# Altium schematic sheet Avionics.SchDoc
size 297 x 210 mm
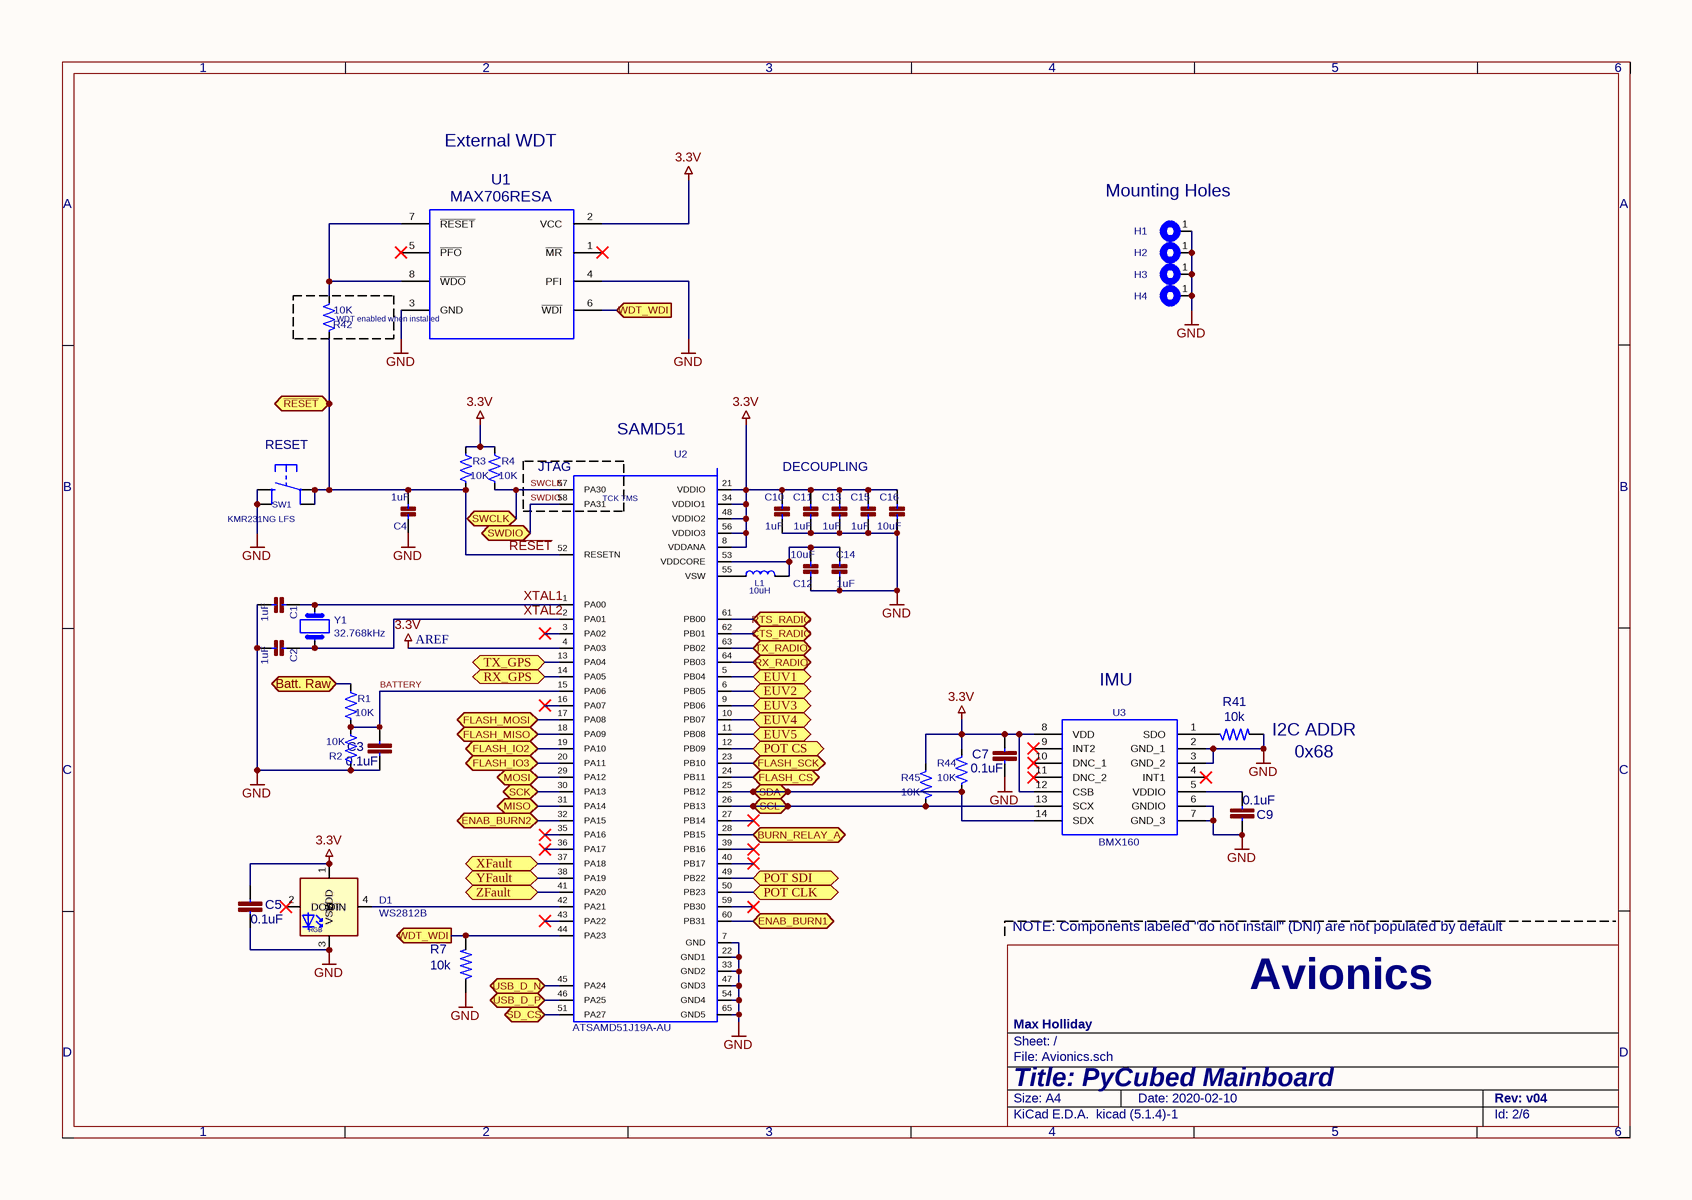
[diagram p0: Avionics.SchDoc]

## Parts
C1  1uF  [C_0603_1608Metric]
C2  1uF  [C_0603_1608Metric]
C3  0.1uF  [C_0603_1608Metric]
C4  1uF  [C_0603_1608Metric]
C5  0.1uF  [C_0603_1608Metric]
C7  0.1uF  [C_0603_1608Metric]
C9  0.1uF  [C_0603_1608Metric]
C10  1uF  [C_0603_1608Metric]
C11  1uF  [C_0603_1608Metric]
C12  10uF  [C_0603_1608Metric]
C13  1uF  [C_0603_1608Metric]
C14  1uF  [C_0603_1608Metric]
C15  1uF  [C_0603_1608Metric]
C16  10uF  [C_0603_1608Metric]
D1  WS2812B  [LED_WS2812B_PLCC4_5.0x5.0mm_P3.2mm]
H1  MountingHole_Pad  [MountingHole_3.2mm_M3_DIN965_Pad]  (value not drawn)  (no BOM)
H2  MountingHole_Pad  [MountingHole_3.2mm_M3_DIN965_Pad]  (value not drawn)  (no BOM)
H3  MountingHole_Pad  [MountingHole_3.2mm_M3_DIN965_Pad]  (value not drawn)  (no BOM)
H4  MountingHole_Pad  [MountingHole_3.2mm_M3_DIN965_Pad]  (value not drawn)  (no BOM)
L1  10uH  [L_0805_2012Metric_Pad1.15x1.40mm_HandSolder]
R1  10K  [R_0603_1608Metric]
R2  10K  [R_0603_1608Metric]
R3  10K  [R_0603_1608Metric]
R4  10K  [R_0603_1608Metric]
R7  10k  [R_0603_1608Metric]
R41  10k  [R_0603_1608Metric]
R42  10K  [R_0603_1608Metric]
R44  10K  [R_0603_1608Metric]
R45  10K  [R_0603_1608Metric]
SW1  KMR231NG LFS  [BTN_KMR2_4.6X2.8]
U1  MAX706RESA  [SO-8_3.9x4.9mm_P1.27mm]
U2  Proto: ATSAMD51J19A-AU  [ATSAMD51J19A-MU]  (hidden comment: 120MHZ 512KB Flash 64 TQFP)
U3  BMX160  [BMX160]
Y1  32.768kHz  [Crystal_SMD_3215-2Pin_3.2x1.5mm]

## Blocks framed on the sheet
WDT enabled / when installed: R42

## Ports
Batt. Raw (bidir), BURN_RELAY_A (bidir), CTS_RADIO (bidir), ENAB_BURN1 (bidir), ENAB_BURN2 (bidir), EUV1 (bidir), EUV2 (bidir), EUV3 (bidir), EUV4 (bidir), EUV5 (bidir), FLASH_CS (bidir), FLASH_IO2 (bidir), FLASH_IO3 (bidir), FLASH_MISO (bidir), FLASH_MOSI (bidir), FLASH_SCK (bidir), MISO (bidir), MOSI (bidir), POT CLK (bidir), POT CS (bidir), POT SDI (bidir), RTS_RADIO (bidir), RX_GPS (bidir), RX_RADIO (bidir), SCK (bidir), SCL (bidir), SD_CS (bidir), SDA (bidir), SWCLK (bidir), SWDIO (bidir), TX_GPS (bidir), TX_RADIO (bidir), USB_D_N (bidir), USB_D_P (bidir), WDT_WDI (in), WDT_WDI (out), XFault (bidir), YFault (bidir), ZFault (bidir), ~{RESET} (bidir)

## Nets
3.3V: C5.1 C7.1 C10.1 C11.1 C13.1 C15.1 C16.1 D1.1(VDD) R3.1 R4.1 R44.1 R45.1 U1.2(VCC) U2.4(PA03) U2.8(VDDANA) U2.21(VDDIO) U2.34(VDDIO1) U2.48(VDDIO2) U2.56(VDDIO3) U3.8(VDD) U3.12(CSB)
GND: C1.2 C2.2 C3.2 C4.1 C5.2 C7.2 C9.1 C10.2 C11.2 C12.1 C13.2 C14.2 C15.2 C16.2 D1.3(VSS) H1.1 H2.1 H3.1 H4.1 R2.1 R7.1 R41.2 SW1.B(S) SW1.B'(S1) U1.3(GND) U1.4(PFI) U2.7(GND) U2.22(GND1) U2.33(GND2) U2.47(GND3) U2.54(GND4) U2.65(GND5) U3.2(GND_1) U3.3(GND_2) U3.6(GNDIO) U3.7(GND_3)
Batt. Raw: R1.1 ; port Batt. Raw
BATTERY: C3.1 R1.2 R2.2 U2.15(PA06)
BURN_RELAY_A: U2.28(PB15) ; port BURN_RELAY_A
CTS_RADIO: U2.62(PB01) ; port CTS_RADIO
ENAB_BURN1: U2.60(PB31) ; port ENAB_BURN1
ENAB_BURN2: U2.32(PA15) ; port ENAB_BURN2
EUV1: U2.5(PB04) ; port EUV1
EUV2: U2.6(PB05) ; port EUV2
EUV3: U2.9(PB06) ; port EUV3
EUV4: U2.10(PB07) ; port EUV4
EUV5: U2.11(PB08) ; port EUV5
FLASH_CS: U2.24(PB11) ; port FLASH_CS
FLASH_IO2: U2.19(PA10) ; port FLASH_IO2
FLASH_IO3: U2.20(PA11) ; port FLASH_IO3
FLASH_MISO: U2.18(PA09) ; port FLASH_MISO
FLASH_MOSI: U2.17(PA08) ; port FLASH_MOSI
FLASH_SCK: U2.23(PB10) ; port FLASH_SCK
MISO: U2.31(PA14) ; port MISO
MOSI: U2.29(PA12) ; port MOSI
POT CLK: U2.50(PB23) ; port POT CLK
POT CS: U2.12(PB09) ; port POT CS
POT SDI: U2.49(PB22) ; port POT SDI
~{RESET}: C4.2 R3.2 R42.1 SW1.A(P) SW1.A'(P1) U2.52(RESETN) ; port ~{RESET}
RTS_RADIO: U2.61(PB00) ; port RTS_RADIO
RX_GPS: U2.14(PA05) ; port RX_GPS
RX_RADIO: U2.64(PB03) ; port RX_RADIO
SCK: U2.30(PA13) ; port SCK
SCL: R45.2 U2.26(PB13) U3.13(SCX) ; port SCL
SD_CS: U2.51(PA27) ; port SD_CS
SDA: R44.2 U2.25(PB12) U3.14(SDX) ; port SDA
SWCLK: R4.2 U2.57(PA30) ; port SWCLK
SWDIO: U2.58(PA31) ; port SWDIO
TX_GPS: U2.13(PA04) ; port TX_GPS
TX_RADIO: U2.63(PB02) ; port TX_RADIO
USB_D_N: U2.45(PA24) ; port USB_D_N
USB_D_P: U2.46(PA25) ; port USB_D_P
WDT_WDI: R7.2 U1.6(~{WDI}) U2.44(PA23) ; port WDT_WDI
XFault: U2.37(PA18) ; port XFault
XTAL1: C1.1 U2.1(PA00) Y1.1
XTAL2: C2.1 U2.2(PA01) Y1.2
YFault: U2.38(PA19) ; port YFault
ZFault: U2.41(PA20) ; port ZFault
NetC9_2: C9.2 U3.5(VDDIO)
NetC12_2: C12.2 C14.1 L1.1 U2.53(VDDCORE)
NetD1_4: D1.4(DIN) U2.42(PA21)
NetL1_2: L1.2 U2.55(VSW)
NetR41_1: R41.1 U3.1(SDO)
NetR42_2: R42.2 U1.7(~{RESET}) U1.8(~{WDO})

Not connected (* = marked no-connect by the designer): D1 2(DOUT)*; U1 1(~{MR})* 5(~{PFO})*; U2 3(PA02)* 16(PA07)* 27(PB14)* 35(PA16)* 36(PA17)* 39(PB16)* 40(PB17)* 43(PA22)* 59(PB30)*; U3 4(INT1)* 9(INT2)* 10(DNC_1)* 11(DNC_2)*

## Notes on the sheet
- External WDT
- (near H1) Mounting Holes
- (near SW1) RESET
- (near U2) JTAG
- (near U2) TCK
  TMS
- (near U2) SAMD51
- DECOUPLING
- AREF
- (near U3) IMU
- 0x68
- (near R41) I2C ADDR
- NOTE: Components labeled "do not install" (DNI) are not populated by default
- Avionics
- 1
- 2
- 3
- 4
- 5
- 6
- A
- B
- C
- D
- Title: PyCubed Mainboard
- File: Avionics.sch
- Sheet: /
- Max Holliday
- KiCad E.D.A.  kicad (5.1.4)-1
- Size: A4
- Date: 2020-02-10
- Rev: v04
- Id: 2/6
- (in symbol WS2812B) RGB

## Library data of the parts
C1 C2 C4 C10 C11 C13-C15 = CAP_CERAMIC0603_NO-Adafruit_Feather_M4_Express-eagle-import-lab64_SAM32-rescue-SAMD-10-rescue-SAM32-rescue: MPN: CL10A105KB8NNNC; Value: 1uF; Footprint: Capacitor_SMD:C_0603_1608Metric
C3 C5 C7 C9 = 0.1UF-25V(+80_-20%)(0603): MPN: CL10B104KB8NNNL; Value: 0.1uF; Footprint: Capacitor_SMD:C_0603_1608Metric
C12 C16 = CAP_CERAMIC0805-NOOUTLINE-Adafruit_Feather_M4_Express-eagle-import-lab64_SAM32-rescue-SAMD-10-rescue-SAM32-rescue: MPN: CL10A106MP8NNNC; Value: 10uF; Footprint: Capacitor_SMD:C_0603_1608Metric
D1 = WS2812B: MPN: COM-16347; Proto: WS2812B; Value: WS2812B; Footprint: LED_SMD:LED_WS2812B_PLCC4_5.0x5.0mm_P3.2mm
L1 = INDUCTOR-Adafruit_Feather_M4_Express-eagle-import-lab64_SAM32-rescue-SAMD-10-rescue-SAM32-rescue: MPN: LBR2012T100K; Value: 10uH; Footprint: Inductor_SMD:L_0805_2012Metric_Pad1.15x1.40mm_HandSolder
R1-R4 R42 R44 R45 = R_US: MPN: CRGCQ0603J10K; Value: 10K; Footprint: Resistor_SMD:R_0603_1608Metric
R7 R41 = R-US_R0603: MPN: RNCP0603FTD10K0; Value: 10k; Footprint: Resistor_SMD:R_0603_1608Metric
SW1 = SWITCH_TACT_SMT4.6X2.8-Adafruit_Feather_M4_Express-eagle-import-lab64_SAM32-rescue-SAMD-10-rescue-SAM32-rescue: Value: KMR231NG LFS; Footprint: Adafruit Feather M4 Express:BTN_KMR2_4.6X2.8; MPN: KMR231NG LFS
U1 = MAX708RESA-T: Proto: MAX706RESA; Value: MAX706RESA; Footprint: Package_SO:SO-8_3.9x4.9mm_P1.27mm; MPN: MAX706RESA
U2 = ATSAMD51J20A-AU-ATSAMD51J20A-AU-lab64_SAM32-rescue-lab64_SAM32-rescue-SAMD-10-rescue-SAM32-rescue: Field4: 120MHZ 512KB Flash 64 TQFP PKG inTray 85CTemp, 64 TQFP 10x10x1mm TRAY; Field5: TQFP-64 Microchip; Value: 120MHZ 512KB Flash 64 TQFP; Footprint: custom-footprints:QFP50P1200X1200X120-64N; MPN: ATSAMD51J19A-AU
Y1 = Crystal: Proto: ABS07-32.768KHZ-T; Value: 32.768kHz; Footprint: Crystal:Crystal_SMD_3215-2Pin_3.2x1.5mm; MPN: ABS07-32.768KHZ-T
H1-H4 = MountingHole_Pad: Value: MountingHole_Pad; Footprint: MountingHole:MountingHole_3.2mm_M3_DIN965_Pad
U3 = BMX160: Proto: BMX160; Value: BMX160; Footprint: custom-footprints:BMX160; MPN: BMX160